# Altium schematic sheet SENSORS.SchDoc
size A3
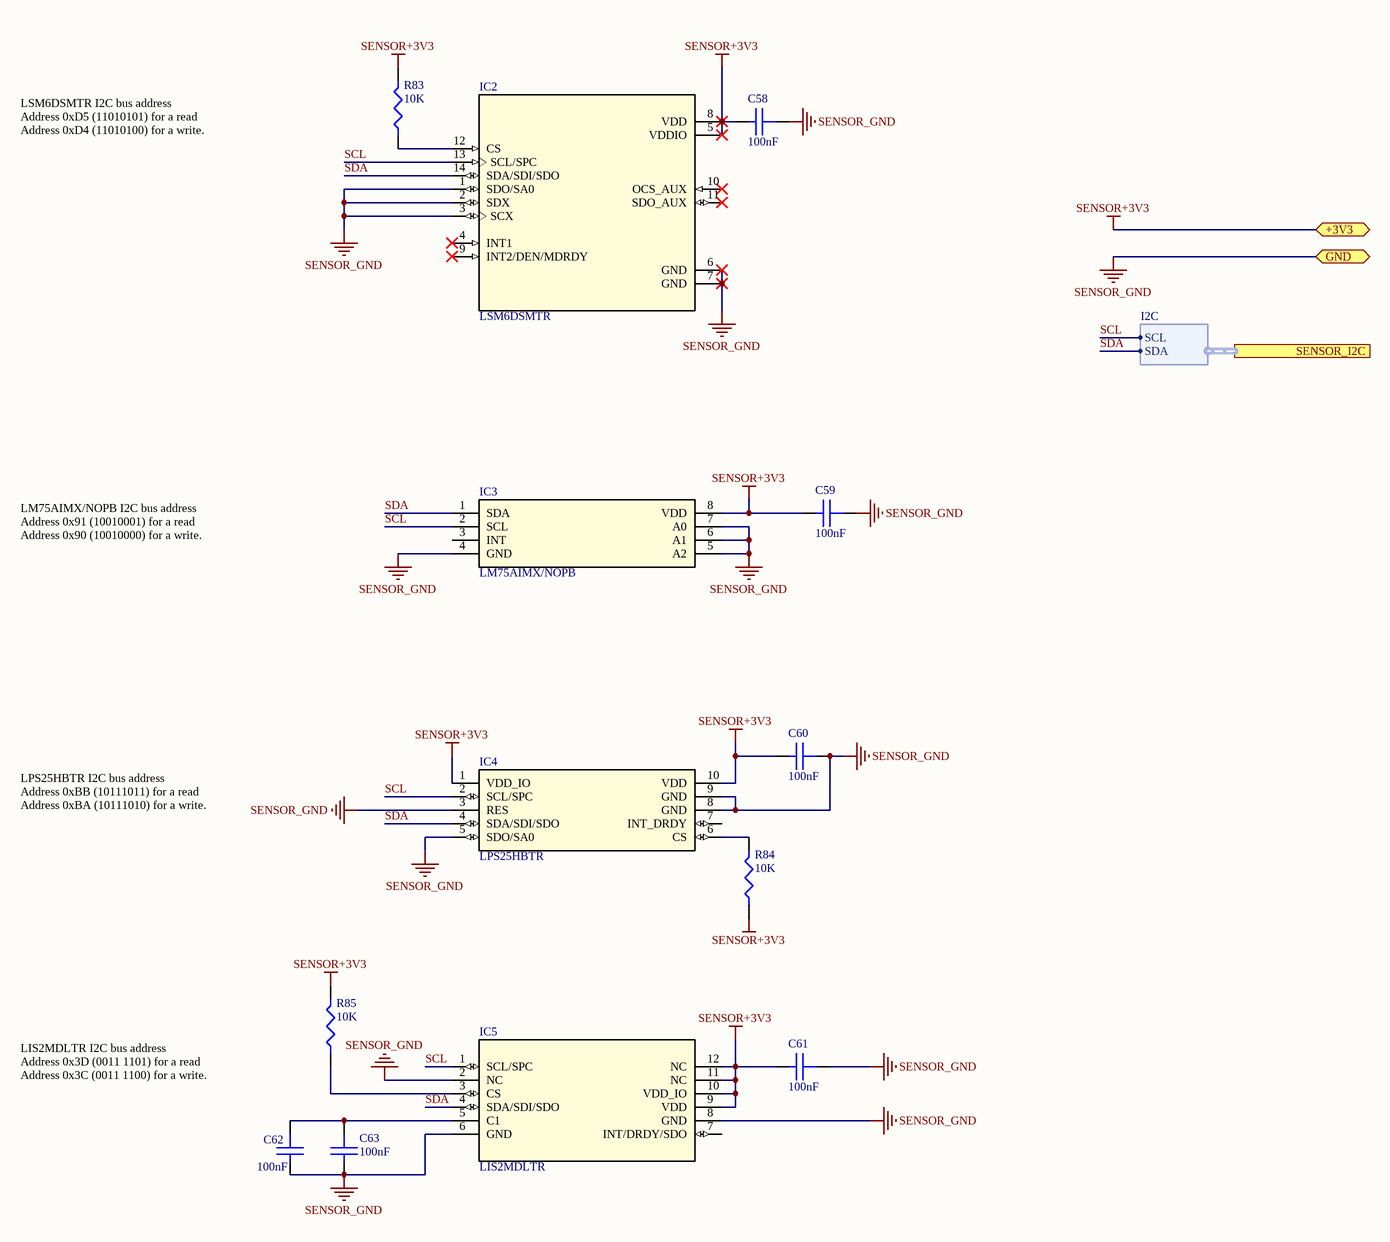
[diagram p0: SENSORS.SchDoc]

## Parts
C58  100nF  [C0603]
C59  100nF  [C0603]
C60  100nF  [C0603]
C61  100nF  [C0603]
C62  100nF  [C0603]
C63  100nF  [C0603]
IC2  LSM6DSMTR  [PQFN50P300X250X86-14N]
IC3  LM75AIMX/NOPB  [SO08]
IC4  LPS25HBTR  [HLGA10_2P5X2P5]
IC5  LIS2MDLTR  [LGA12]
R83  10K  [R0603]
R84  10K  [R0603]
R85  10K  [R0603]

## Ports
+3V3 (bidir), GND (bidir), SENSOR_I2C (harness I2C)

## Harnesses
I2C: SCL, SDA

## Nets
SENSOR+3V3: C58.1 C59.1 C60.1 C61.1 IC2.5(VDDIO) IC2.8(VDD) IC3.8(VDD) IC4.1(VDD_IO) IC4.10(VDD) IC5.9(VDD) IC5.10(VDD_IO) IC5.11(NC) IC5.12(NC) R83.2 R84.1 R85.2 ; port +3V3
SENSOR_GND: C58.2 C59.2 C60.2 C61.2 C62.1 C63.1 IC2.1(SDO/SA0) IC2.2(SDX) IC2.3(SCX) IC2.6(GND) IC2.7(GND) IC3.4(GND) IC3.5(A2) IC3.6(A1) IC3.7(A0) IC4.3(RES) IC4.5(SDO/SA0) IC4.8(GND) IC4.9(GND) IC5.2(NC) IC5.6(GND) IC5.8(GND) ; port GND
SCL: IC2.13(SCL/SPC) IC3.2(SCL) IC4.2(SCL/SPC) IC5.1(SCL/SPC) ; port SENSOR_I2C.SCL
SDA: IC2.14(SDA/SDI/SDO) IC3.1(SDA) IC4.4(SDA/SDI/SDO) IC5.4(SDA/SDI/SDO) ; port SENSOR_I2C.SDA
NetC62_2: C62.2 C63.2 IC5.5(C1)
NetIC2_12: IC2.12(CS) R83.1
NetIC4_6: IC4.6(CS) R84.2
NetIC5_3: IC5.3(CS) R85.1

Not connected (* = marked no-connect by the designer): IC2 4(INT1)* 9(INT2/DEN/MDRDY)* 10(OCS_AUX)* 11(SDO_AUX)*; IC3 3(INT); IC4 7(INT_DRDY); IC5 7(INT/DRDY/SDO)

## Notes on the sheet
- LSM6DSMTR I2C bus address
  Address 0xD5 (11010101) for a read
  Address 0xD4 (11010100) for a write.
- LM75AIMX/NOPB I2C bus address
  Address 0x91 (10010001) for a read
  Address 0x90 (10010000) for a write.
- LPS25HBTR I2C bus address
  Address 0xBB (10111011) for a read
  Address 0xBA (10111010) for a write.
- LIS2MDLTR I2C bus address
  Address 0x3D (0011 1101) for a read
  Address 0x3C (0011 1100) for a write.
- Tarih/Date
- Kont/Check
- Onay/Appr
- Haz/Prep
- Ortam/Env
- Sayfa/Sht
- Form
- /
- Deg Tarihi/Chng Date
- Deg Onay/Chng Appr
- Rev
- All rights reserved. No part of this document may be reproduced or transmitted in any form or by any means, electronic, mechanical, photocopying, recording, or otherwise, without prior written permission of

## Library data of the parts
C58-C63 = CC0603KRX7R8BB104: 100nF, 25V, X7R, 10%, 0603; Manufacturer: Yageo; Supplier 1: Digi-Key; Supplier Part Number 1: 311-1341-1-ND; Manufacturer Part Number: CC0603KRX7R8BB104; Stock 1: 10150433; Pricing 1: 1 = 0,10000, 10 = 0,04500, 50 = 0,02480, 100 = 0,02020, 500 = 0,01444, 1000 = 0,01134 (USD); RoHS: Yes; Mount: Surface Mount; Case/Package: 0603; Number of Pins: 2; Case Code (Imperial): 0603; Case Code (Metric): 1608; Min Operating Temperature: -55°C; Max Operating Temperature: 125°C; Capacitance: 100nF; Tolerance: 10%; Voltage Rating: 25V; Packaging: Tape and Reel; Package Quantity: 1; Voltage Rating (DC): 25V; Dielectric: X7R; Termination: SMD/SMT; Resistor Type: Ceramic; Voltage: 25V; Length: 1.6mm; Width: 0.8mm; Height: 0.8mm; Thickness: 0.035inch; Depth: 0.8mm; Radiation Hardening: No; REACH SVHC: Unknown; Lead Free: Lead Free; Halogen Free: Halogen Free; ComponentLink1URL: https://datasheet.ciiva.com/11786/0900766b80c10176-11786120.pdf?src-supplier=RSComponents; ComponentLink1Description: https://datasheet.ciiva.com/11786/0900766b80c10176-11786120.pdf?src-supplier=RSComponents; ComponentLink2URL: https://datasheet.ciiva.com/144/mlccorderingcode-144075.pdf?src-supplier=Digi-Key; ComponentLink2Description: https://datasheet.ciiva.com/144/mlccorderingcode-144075.pdf?src-supplier=Digi-Key; ComponentLink3URL: https://datasheet.ciiva.com/17434/upy-gphc-x7r-6-3v-to-50v-8-17434263.pdf?src-supplier=Avnet+Europe; ComponentLink3Description: https://datasheet.ciiva.com/17434/upy-gphc-x7r-6-3v-to-50v-8-17434263.pdf?src-supplier=Avnet+Europe; ComponentLink4URL: https://datasheet.ciiva.com/26829/getdatasheetpartid-403577-26829431.pdf?src-supplier=Verical; ComponentLink4Description: https://datasheet.ciiva.com/26829/getdatasheetpartid-403577-26829431.pdf?src-supplier=Verical; ComponentLink5URL: https://datasheet.ciiva.com/11587/upy-gphc-x7r-6-3v-to-50v-8-11587208.pdf?src-supplier=Avnet; ComponentLink5Description: https://datasheet.ciiva.com/11587/upy-gphc-x7r-6-3v-to-50v-8-11587208.pdf?src-supplier=Avnet; ComponentLink6URL: https://datasheet.ciiva.com/13389/upy-gphc-x7r-6-3v-to-50v-8-13389352.pdf?src-supplier=Mouser; ComponentLink6Description: https://datasheet.ciiva.com/13389/upy-gphc-x7r-6-3v-to-50v-8-13389352.pdf?src-supplier=Mouser; ComponentLink7URL: https://datasheet.ciiva.com/28450/1489800-28450584.pdf?src-supplier=Element14; ComponentLink7Description: https://datasheet.ciiva.com/28450/1489800-28450584.pdf?src-supplier=Element14; ComponentLink8URL: https://datasheet.ciiva.com/144/mlccorderingcode-144073.pdf?src-supplier=Digi-Key; ComponentLink8Description: https://datasheet.ciiva.com/144/mlccorderingcode-144073.pdf?src-supplier=Digi-Key; ComponentLink9URL: https://datasheet.ciiva.com/144/mlccorderingcode-144074.pdf?src-supplier=Digi-Key; ComponentLink9Description: https://datasheet.ciiva.com/144/mlccorderingcode-144074.pdf?src-supplier=Digi-Key; ComponentLink10URL: https://datasheet.ciiva.com/7978/1489800-7978155.pdf?src-supplier=Element14; ComponentLink10Description: https://datasheet.ciiva.com/7978/1489800-7978155.pdf?src-supplier=Element14; Category: Capasitor
IC2 = LSM6DSMTR: IMU ACCEL/GYRO I2C/SPI 14LGA; Manufacturer: STMicroelectronics; Min Supply Voltage: 1.71V; Max Supply Voltage: 3.6V; ComponentLink1URL: http://www.farnell.com/datasheets/2151220.pdf?src-supplier=Farnell; ComponentLink1Description: http://www.farnell.com/datasheets/2151220.pdf?src-supplier=Farnell; ComponentLink2URL: https://www.mouser.com/ds/2/389/lsm6dsm-973702.pdf?src-supplier=Mouser; ComponentLink2Description: https://www.mouser.com/ds/2/389/lsm6dsm-973702.pdf?src-supplier=Mouser; ComponentLink3URL: http://www.st.com/content/ccc/resource/technical/document/datasheet/76/27/cf/88/c5/03/42/6b/DM00218116.pdf/files/DM00218116.pdf/jcr:content/translations/en.DM00218116.pdf?src-supplier=Digi-Key; ComponentLink3Description: http://www.st.com/content/ccc/resource/technical/document/datasheet/76/27/cf/88/c5/03/42/6b/DM00218116.pdf/files/DM00218116.pdf/jcr:content/translations/en.DM00218116.pdf?src-supplier=Digi-Key; ComponentLink4URL: http://www.farnell.com/datasheets/2151220.pdf?src-supplier=Element14; ComponentLink4Description: http://www.farnell.com/datasheets/2151220.pdf?src-supplier=Element14; ComponentLink5URL: http://www.st.com/content/ccc/resource/sales_and_marketing/promotional_material/flyer/7a/04/ee/af/e2/19/46/66/fllsm6dsm0216.pdf/files/fllsm6dsm0216.pdf/jcr:content/translations/en.fllsm6dsm0216.pdf?src-supplier=Digi-Key; ComponentLink5Description: http://www.st.com/content/ccc/resource/sales_and_marketing/promotional_material/flyer/7a/04/ee/af/e2/19/46/66/fllsm6dsm0216.pdf/files/fllsm6dsm0216.pdf/jcr:content/translations/en.fllsm6dsm0216.pdf?src-supplier=Digi-Key; Category: Sensors, Transducers; Supplier 1: Digi-Key; Manufacturer Part Number: LSM6DSMTR; Stock 1: 5847; Pricing 1: 1 = 3,00000, 10 = 2,69700, 25 = 2,54920, 100 = 2,09610, 250 = 1,88080, 500 = 1,81280, 1000 = 1,50689, 2500 = 1,45024 (USD); RoHS: No; Case/Package: LGA; Number of Pins: 14; Packaging: Cut Tape; REACH SVHC: No SVHC; Supplier Part Number 1: 497-16696-6-ND
IC3 = LM75AIMX/NOPB: SENSOR DIGITAL -55C-125C 8SOIC; Manufacturer: TI National Semiconductor; Interface: I2C,SMBus,2-Wire; Max Supply Voltage: 5.5V; Min Supply Voltage: 2.7V; Output Current: 1uA; Resolution: 9b; Operating Supply Current: 280uA; Quiescent Current: 500uA; Number of Bits: 9; Output Type: I2C,Digital; Supplier 1: Digi-Key; Manufacturer Part Number: LM75AIMX/NOPB; Stock 1: 21295; Pricing 1: 1 = 1,81000, 5 = 1,74200, 10 = 1,41600, 25 = 1,21960, 50 = 1,05640, 100 = 0,95830, 500 = 0,80586, 1000 = 0,71874 (USD); RoHS: Yes; Mount: Surface Mount; Case/Package: SOIC; Number of Pins: 8; Contact Plating: Tin; Min Operating Temperature: -55°C; Max Operating Temperature: 125°C; Packaging: Tape and Reel; Package Quantity: 2500; Max Supply Voltage (DC): 5.5V; Min Supply Voltage (DC): 2.7V; Radiation Hardening: No; REACH SVHC: No SVHC; Lead Free: Lead Free; ComponentLink1URL: https://datasheet.ciiva.com/3277/lm75a-3277942.pdf?src-supplier=Avnet; ComponentLink1Description: https://datasheet.ciiva.com/3277/lm75a-3277942.pdf?src-supplier=Avnet; ComponentLink2URL: https://datasheet.ciiva.com/46417/1841923-46417014.pdf?src-supplier=Element14; ComponentLink2Description: https://datasheet.ciiva.com/46417/1841923-46417014.pdf?src-supplier=Element14; ComponentLink3URL: https://datasheet.ciiva.com/6598/lm75a-6598537.pdf?src-supplier=Digi-Key; ComponentLink3Description: https://datasheet.ciiva.com/6598/lm75a-6598537.pdf?src-supplier=Digi-Key; ComponentLink4URL: https://datasheet.ciiva.com/6598/lm75a-6598538.pdf?src-supplier=Digi-Key; ComponentLink4Description: https://datasheet.ciiva.com/6598/lm75a-6598538.pdf?src-supplier=Digi-Key; ComponentLink5URL: https://datasheet.ciiva.com/6598/lm75a-6598539.pdf?src-supplier=Digi-Key; ComponentLink5Description: https://datasheet.ciiva.com/6598/lm75a-6598539.pdf?src-supplier=Digi-Key; Supplier Part Number 1: LM75AIMX/NOPBCT-ND; Category: Sensors, Transducers
IC4 = LPS25HBTR: IC MEMS PRESSURE SENSOR 10HCLGA; Manufacturer: STMicroelectronics; Operating Pressure: 18.27PSI; Port Style: No Port; Max Pressure: 290.08PSI; Min Supply Voltage: 1.7V; Max Supply Voltage: 3.6V; Output Type: SPI,I2C; Pressure Type: Absolute; Supplier 1: Digi-Key; Manufacturer Part Number: LPS25HBTR; Stock 1: 1317; Pricing 1: 1 = 4,05000, 10 = 3,63900, 25 = 3,44040, 100 = 2,98160, 500 = 2,53814, 1000 = 2,14060 (USD); RoHS: Yes; Mount: Surface Mount; Number of Pins: 10; Contact Plating: Gold; Min Operating Temperature: -30°C; Max Operating Temperature: 105°C; Termination: Solder; REACH SVHC: No SVHC; Lead Free: Lead Free; ComponentLink1URL: http://www.farnell.com/datasheets/2309000.pdf?src-supplier=Farnell; ComponentLink1Description: http://www.farnell.com/datasheets/2309000.pdf?src-supplier=Farnell; ComponentLink2URL: https://www.mouser.com/ds/2/389/lps25hb-954985.pdf?src-supplier=Mouser; ComponentLink2Description: https://www.mouser.com/ds/2/389/lps25hb-954985.pdf?src-supplier=Mouser; ComponentLink3URL: http://www.st.com/content/ccc/resource/technical/document/datasheet/9a/4c/aa/72/1f/45/4e/24/DM00141379.pdf/files/DM00141379.pdf/jcr:content/translations/en.DM00141379.pdf?src-supplier=Digi-Key; ComponentLink3Description: http://www.st.com/content/ccc/resource/technical/document/datasheet/9a/4c/aa/72/1f/45/4e/24/DM00141379.pdf/files/DM00141379.pdf/jcr:content/translations/en.DM00141379.pdf?src-supplier=Digi-Key; ComponentLink4URL: http://www.farnell.com/datasheets/2309000.pdf?src-supplier=Newark; ComponentLink4Description: http://www.farnell.com/datasheets/2309000.pdf?src-supplier=Newark; ComponentLink5URL: http://www.farnell.com/datasheets/1992925.pdf?src-supplier=Element14; ComponentLink5Description: http://www.farnell.com/datasheets/1992925.pdf?src-supplier=Element14; ComponentLink6URL: http://www.st.com/st-web-ui/static/active/en/resource/technical/document/datasheet/DM00141379.pdf?src-supplier=Avnet; ComponentLink6Description: http://www.st.com/st-web-ui/static/active/en/resource/technical/document/datasheet/DM00141379.pdf?src-supplier=Avnet; ComponentLink7URL: http://www.st.com/st-web-ui/static/active/en/resource/technical/document/datasheet/DM00141379.pdf?src-supplier=Avnet+Asia; ComponentLink7Description: http://www.st.com/st-web-ui/static/active/en/resource/technical/document/datasheet/DM00141379.pdf?src-supplier=Avnet+Asia; Category: Sensors, Transducers; Stock 2: 757; Pricing 2: 1 = 4,05000, 10 = 3,63900, 25 = 3,44040, 100 = 2,98160, 500 = 2,53814, 1000 = 2,14060 (USD); Supplier Part Number 1: 497-15070-1-ND
IC5 = LIS2MDLTR: ULTRA-COMPACT HIGH-PERFORMANCE E; Manufacturer: STMicroelectronics; Supplier 1: Digi-Key; Manufacturer Part Number: LIS2MDLTR; Stock 1: 20734; Pricing 1: 1 = 1,95000, 10 = 1,74900, 25 = 1,65000, 100 = 1,40580, 500 = 1,15500, 1000 = 0,95700, 5000 = 0,85800 (USD); RoHS: No; ComponentLink1URL: http://www.st.com/content/ccc/resource/technical/document/datasheet/group3/29/13/d1/e0/9a/4d/4f/30/DM00395193/files/DM00395193.pdf/jcr:content/translations/en.DM00395193.pdf?src-supplier=Digi-Key; ComponentLink1Description: http://www.st.com/content/ccc/resource/technical/document/datasheet/group3/29/13/d1/e0/9a/4d/4f/30/DM00395193/files/DM00395193.pdf/jcr:content/translations/en.DM00395193.pdf?src-supplier=Digi-Key; Supplier Part Number 1: 497-17588-6-ND; Category: Sensors, Transducers
R83-R85 = RT0603FRE0710KL: 10K OHM 1% 1/10W 0603; Manufacturer: Yageo; Resistance: 10kR; Power Rating: 100mW; Voltage Rating: 75V; Temperature Coefficient: 50ppm/°C; Supplier 1: Digi-Key; Supplier Part Number 1: YAG2321CT-ND; Manufacturer Part Number: RT0603FRE0710KL; Stock 1: 326134; Pricing 1: 1 = 0,10000, 10 = 0,05600, 100 = 0,02270, 1000 = 0,01020, 2500 = 0,00886 (USD); RoHS: Yes; Case/Package: 0603; Number of Pins: 2; Case Code (Metric): 1608; Case Code (Imperial): 0603; Contact Plating: Tin,Lead; Min Operating Temperature: -55°C; Max Operating Temperature: 125°C; Package Quantity: 5000; Packaging: Tape and Reel; Tolerance: 1%; Resistor Type: Thin Film; Number of Terminations: 2; Termination: SMD/SMT; Max Power Dissipation: 100mW; Voltage Rating (DC): 75V; Features: Moisture Resistant; Length: 0.063inch; Width: 0.031inch; Height: 0.022inch; Depth: 0.8mm; REACH SVHC: Unknown; Military Standard: Not; Lead Free: Lead Free; ComponentLink1URL: https://datasheet.ciiva.com/2559/pyu-rt-1-to-0-05-rohs-l-5-2559482.pdf?src-supplier=Digi-Key; ComponentLink1Description: https://datasheet.ciiva.com/2559/pyu-rt-1-to-0-05-rohs-l-5-2559482.pdf?src-supplier=Digi-Key; ComponentLink2URL: https://datasheet.ciiva.com/16745/pyu-rt-1-to-0-05-rohs-l-4-16745739.pdf?src-supplier=Future+Electronics; ComponentLink2Description: https://datasheet.ciiva.com/16745/pyu-rt-1-to-0-05-rohs-l-4-16745739.pdf?src-supplier=Future+Electronics; ComponentLink3URL: https://datasheet.ciiva.com/12694/pyu-rt-1-to-0-05-rohs-l-4-12694910.pdf?src-supplier=Mouser; ComponentLink3Description: https://datasheet.ciiva.com/12694/pyu-rt-1-to-0-05-rohs-l-4-12694910.pdf?src-supplier=Mouser; Category: Resistor